# EAGLE design Detektor hran (EAGLE 8.2.0)
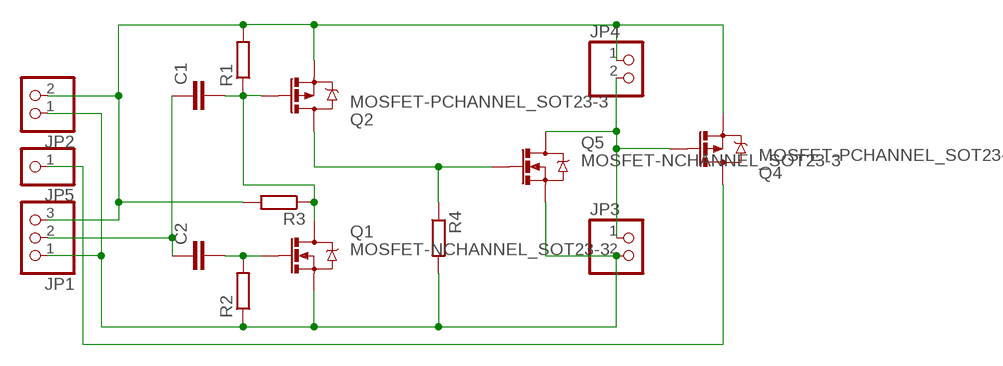
[diagram p0: schematic, sheet 1]

## Parts
C1  C-EUC0805  [C0805]
C2  C-EUC0805  [C0805]
JP1  PINHD-1X03_2.54  [1X03]
JP2  PINHD-1X02_2.54  [1X02]
JP3  PINHD-1X02_2.54  [1X02]
JP4  PINHD-1X02_2.54  [1X02]
JP5  PINHD-1X01_2.54-90°  [1X01/90]
Q1  MOSFET-NCHANNEL_SOT23-3  [SOT23-3]
Q2  MOSFET-PCHANNEL_SOT23-3  [SOT23-3]
Q4  MOSFET-PCHANNEL_SOT23-3  [SOT23-3]
Q5  MOSFET-NCHANNEL_SOT23-3  [SOT23-3]
R1  R-EU_R0805  [R0805]
R2  R-EU_R0805  [R0805]
R3  R-EU_R0805  [R0805]
R4  R-EU_R0805  [R0805]

## Nets
GND: JP1.1 JP2.1 JP3.2 Q1.2(S) Q5.2(S) R2.1 R4.2
N$2: JP3.1 JP4.2 Q4.1(G) Q5.3(D)
N$3: C1.1 C2.1 JP1.2
N$4: C1.2 Q1.3(D) Q2.1(G) R1.1 R3.1
N$5: C2.2 Q1.1(G) R2.2
N$6: JP5.1 Q4.3(D)
N$7: Q2.3(D) Q5.1(G) R4.1
V+: JP1.3 JP2.2 JP4.1 Q2.2(S) Q4.2(S) R1.2 R3.2

## Library data of the parts
C1 C2 = rcl:C-EU: CAPACITOR, European symbol
JP1 = untitled:PINHD-1X03: PIN HEADER
JP2-JP4 = untitled:PINHD-1X02: PIN HEADER
JP5 = untitled:PINHD-1X01: PIN HEADER
Q1 Q5 = Simplex-DiscreteSemi:MOSFET-NCHANNEL: Generic N-channel mosfet
Q2 Q4 = Simplex-DiscreteSemi:MOSFET-PCHANNEL: Generic P-channel mosfet
R1-R4 = rcl:R-EU_: RESISTOR, European symbol

## Board
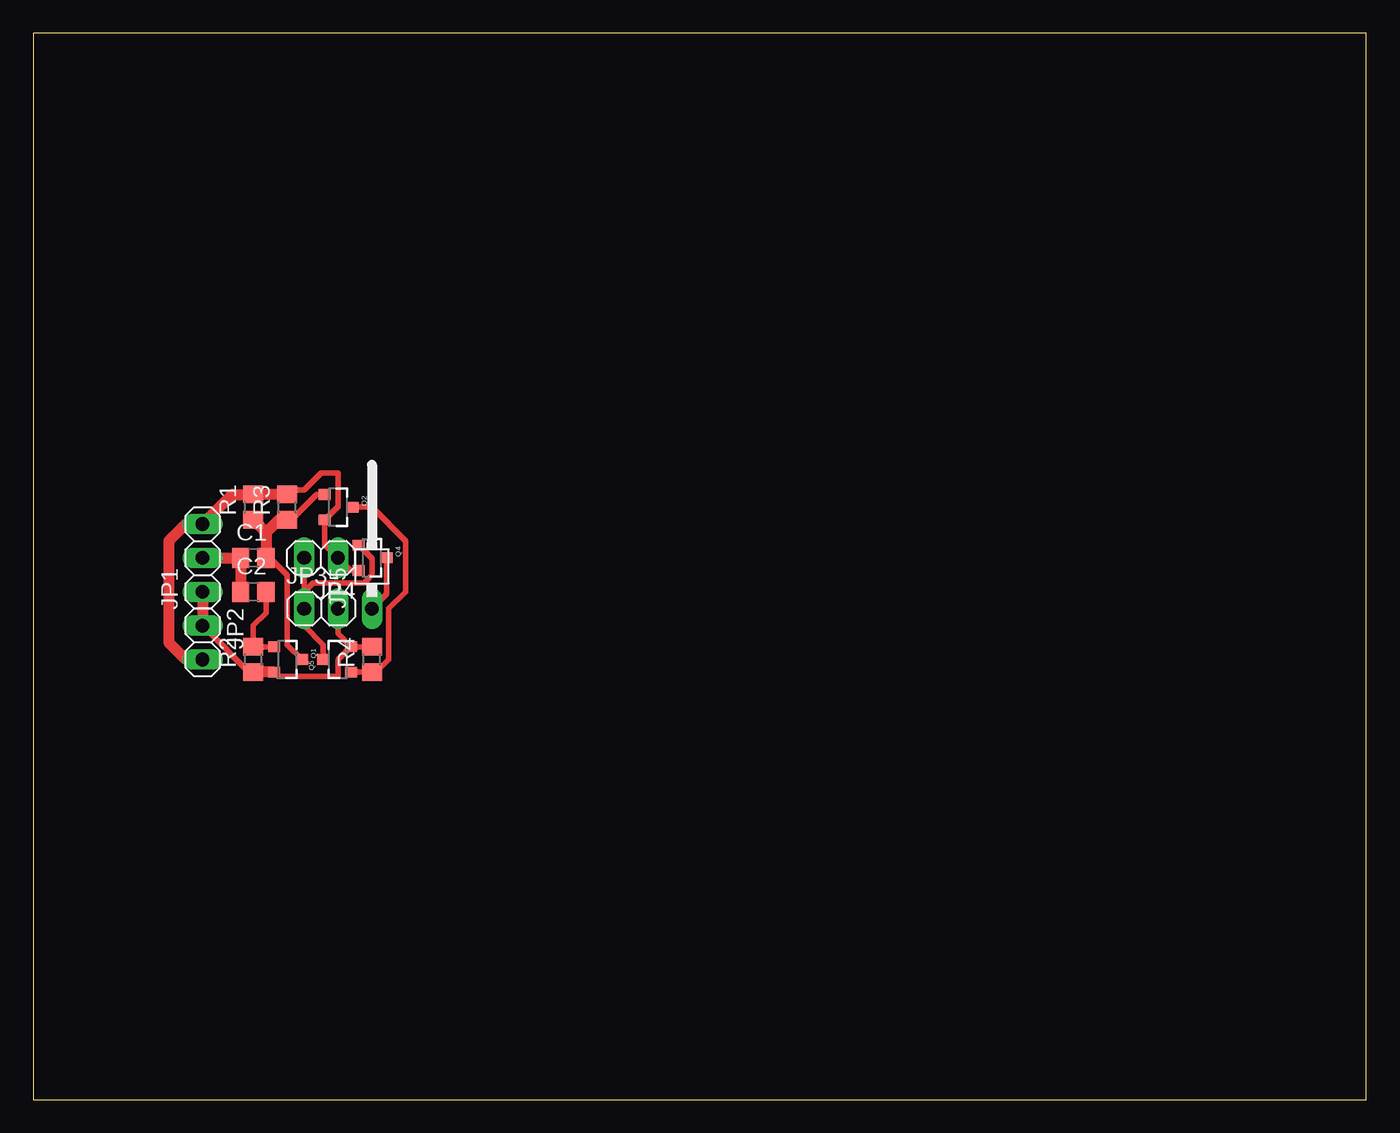
[diagram p1: board, top side]

Size 100 x 80 mm. Coordinates in mm from the lower left corner, seen from the top.
Outline: 0,0 100,0 100,80 0,80 0,0
Copper layers (1*16): Top 0.035mm / dielectric 1.5mm / Bottom 0.035mm
Design rules "default": minimum track width 6mil, minimum drill 0.35mm, track to track 6mil, track to pad 6mil, pad to pad 6mil, via to via 6mil, smd to smd 6mil, copper to edge 40mil, drill to drill 6mil, minimum pad ring 10mil, minimum via ring 8mil, stop-mask expansion 4mil, vias tented up to drill 0mil, thermal gap 10mil

### Footprints (pad centres in the part's own frame; a part is rotated, then mirrored left to right if it is on the bottom)
C0805 = smd 1.3 x 1.5: 1 -0.95,0; 2 0.95,0
1X03 = drill 1.016 long: 1 -2.54,0; 2 0,0; 3 2.54,0
1X02 = drill 1.016 long: 1 -1.27,0; 2 1.27,0
1X01/90 = drill 1.016 long: 1 -1.27,-3.81
SOT23-3 = smd 0.8 x 0.9: 1 -0.95,-1; 2 0.95,-1; 3 0,1.1
R0805 = smd 1.3 x 1.5: 1 -0.95,0; 2 0.95,0

### Placement (x,y rotation side)
C1  16.51,40.64 0 top
C2  16.51,38.1 0 top
JP1  12.7,40.64 90 top
JP2  12.7,34.29 270 top
JP3  21.59,36.83 0 top
JP4  21.59,40.64 180 top
JP5  26.67,40.64 0 top
Q1  19.05,33.02 270 top
Q2  22.86,44.45 270 top
Q4  25.4,40.64 270 top
Q5  22.86,33.02 90 top
R1  16.51,44.45 90 top
R2  16.51,33.02 90 top
R3  19.05,44.45 90 top
R4  25.4,33.02 90 top

### Tracks (layer width: path | path; a pad name or v marks a point on that pad's centre or on a via)
GND
  Top 0.406: R2.1 16.51,31.75 JP2.1 | JP3.2 22.86,34.97 Q5.2 | Q5.2 23.81,33.97 22.86,33.02 22.86,31.75 18.37,31.75 Q1.2 | R4.2 Q5.2
  Top 0.813: JP1.1 JP2.1 | Q1.2 R2.1
N$2
  Top 0.406: 20.32,38.1 JP3.1 20.32,35.56 21.76,34.12 Q5.3 | 20.32,38.1 JP4.2 | 24.45,41.59 Q4.1 25.4,40.59 25.4,39.37 25.21,39.18 25.21,39.14 24.82,38.76 20.98,38.76 20.32,38.1
N$3
  Top 0.813: JP1.2 C1.1 C2.1
N$4
  Top 0.406: Q2.1 21.27,45.4 19.05,43.18 R3.1 | C1.2 17.78,40.64 19.05,39.37 19.05,34.12 Q1.3
  Top 0.813: 17.46,42.55 C1.2 | 17.46,42.55 R1.1 | R3.1 18.41,43.5 17.46,42.55
N$5
  Top 0.406: C2.2 17.46,36.51 16.51,35.56 R2.2 Q1.1
N$6
  Top 0.406: Q4.3 26.5,37.93 JP5.1
N$7
  Top 0.406: Q5.1 R4.1 25.4,31.75 26.67,33.02 26.67,36.83 27.94,38.1 27.94,41.91 25.4,44.45 Q2.3
V+
  Top 0.406: Q4.2 23.81,39.69 JP4.1 21.86,41.64 Q2.2 22.86,44.5 22.86,46.99 21.59,46.99 20.32,45.72 19.37,45.72 R3.2
  Top 0.813: JP2.2 11.43,33.02 10.16,34.29 10.16,41.91 11.43,43.18 JP1.3 14.92,45.4 R1.2 R3.2